# EasyEDA Pro project salvador.epro, board PCB1
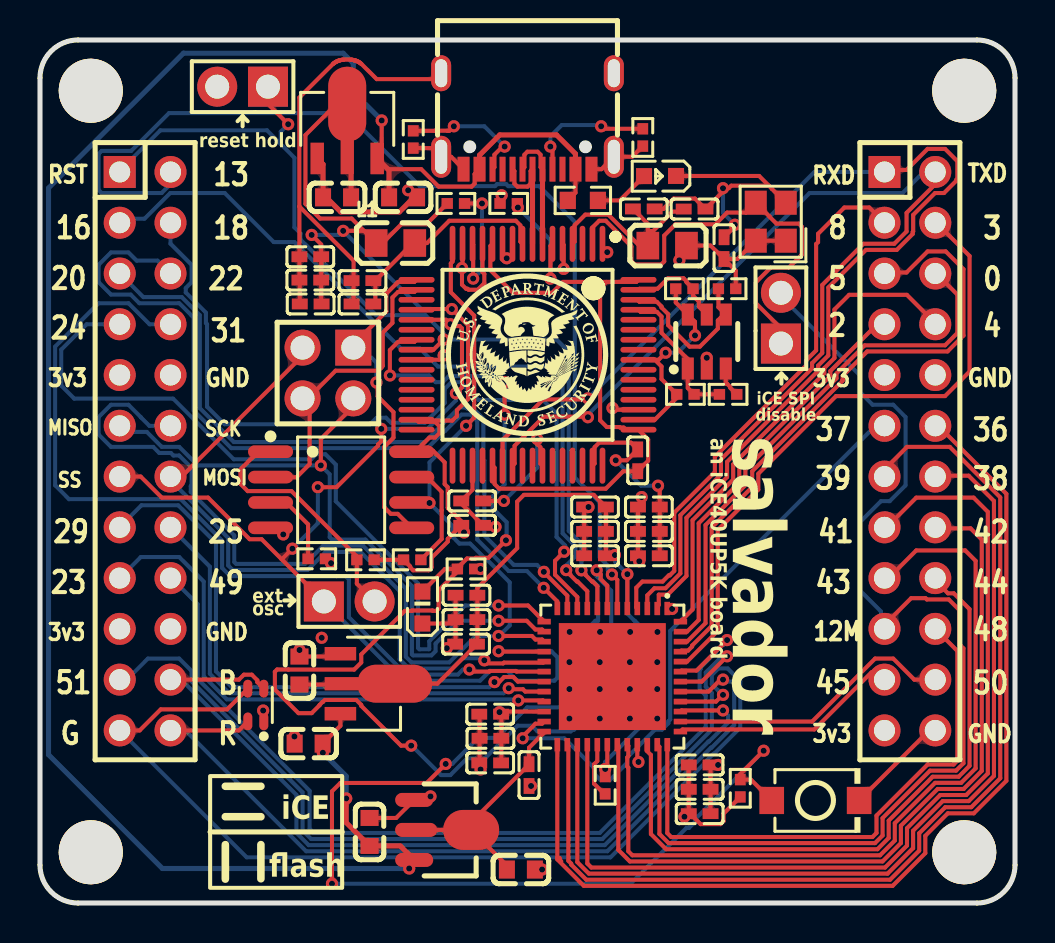
[diagram p1: board, top side]
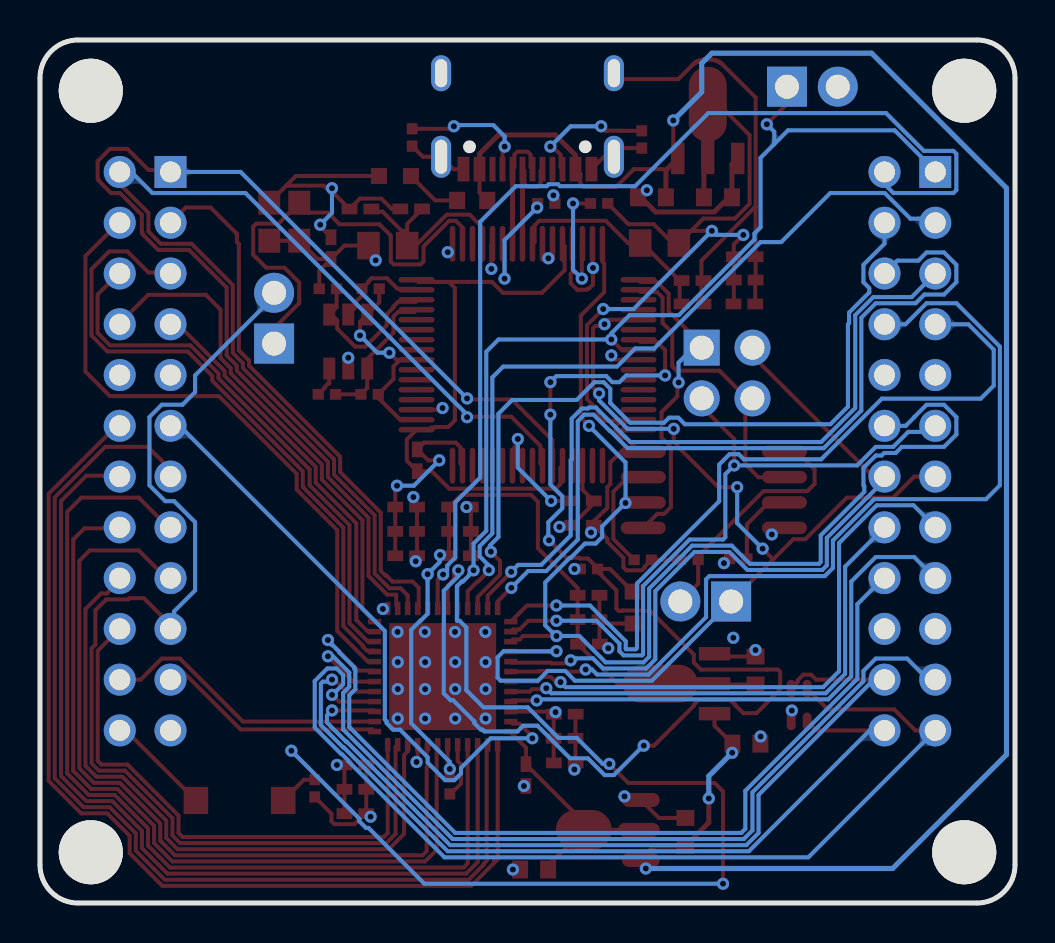
[diagram p2: board, bottom side, seen from below]

Outline 48.77 x 43.18 mm; copper layers: Top Layer, Inner1, Inner2, Bottom Layer. Coordinates in mm from the lower left corner of the outline.
Outline path: 0,41.28 0,1.91 arc(0.56,0.56) 1.91,0 46.86,0 arc(48.21,0.56) 48.77,1.91 48.77,41.28 arc(48.21,42.62) 46.86,43.18 1.91,43.18 arc(0.56,42.62) 0,41.28
Stack: Top Layer 0.035mm Outer layer thickness 1oz / Dielectric1 0.2104mm 7628 RC49% 8.6mil / Inner1 0.0152mm Inner layer thickness / Dielectric2 1.065mm 1.1mm H/HOZ Copper / Inner2 0.0152mm Inner layer thickness / Dielectric3 0.2104mm 7628 RC49% 8.6mil / Bottom Layer 0.035mm Outer layer thickness 1oz

## Design rules (mm)
net D+: DP1
net D-: DP1
template: Custom Config
spacing copperThickness1oz (default): track to track 0.102, other pairs 0.152 to 0.3
spacing copperThickness2oz: track to track 0.203, other pairs 0.152 to 0.3
track width copperThickness1oz (default): min 0.127, default 0.203, max 2.54
track width copperThickness2oz: min 0.203, default 0.254, max 2.54
differential pair differentialPair (default): width min 0.127, default 0.254, max 2.54; gap min 0.152, default 0.152
via viaSize (default): diameter min 0.5, default 0.61, max 10; hole min 0.3, default 0.305, max 6.3

## Placement (name value [footprint] x y rotation side)
C1  10uF  [C0603]  18.16 35.31 0 top
C2  10uF  [C0603]  14.86 35.31 180 top
C3  10uF  [C0603]  16.48 3.56 90 top
C4  10uF  [C0603]  24.05 1.68 0 top
C5  10uF  [C0603]  12.98 11.63 90 top
C6  10uF  [C0603]  13.44 7.98 180 top
C7  1uF  [C0402]  30.45 17.37 0 top
C8  100nF  [C0402]  30.45 18.59 0 top
C9  10nF  [C0402]  30.45 19.81 0 top
C10  1uF  [C0402]  27.76 17.37 180 top
C11  100nF  [C0402]  27.76 18.59 180 top
C12  10nF  [C0402]  27.76 19.81 180 top
C13  1uF  [C0402]  22.52 7.01 180 top
C14  100nF  [C0402]  22.53 8.24 180 top
C15  10nF  [C0402]  22.52 9.45 180 top
C17  100nF  [C0402]  24.46 6.4 270 top
C19  1uF  [C0402]  21.31 12.95 180 top
C20  100nF  [C0402]  21.33 14.18 180 top
C21  10nF  [C0402]  21.33 15.4 180 top
C22  1uF  [C0402]  32.99 6.91 0 top
C23  100nF  [C0402]  32.99 5.69 0 top
C24  10nF  [C0402]  32.99 4.47 0 top
C25  4.7uF  [C0402]  16.13 31.14 180 top
C26  100nF  [C0402]  32.74 34.72 0 top
C27  4.7uF  [C0402]  30.2 34.73 0 top
C28  100nF  [C0402]  16.13 29.97 180 top
C29  4.7uF  [C0402]  29.9 22.15 90 top
C30  100nF  [C0402]  21.62 20.12 180 top
C31  100nF  [C0402]  13.54 29.97 180 top
C32  100nF  [C0402]  13.52 31.17 180 top
C33  100nF  [C0402]  13.52 32.33 180 top
C34  100nF  [C0402]  34.21 32.77 90 top
C35  100nF  [C0402]  21.62 18.9 0 top
H1  PZ254V-11-02P  [HDR-TH_2P-P2.54-V-M]  37.06 29.26 90 top
H2  PZ254V-11-02P  [HDR-TH_2P-P2.54-V-M]  10.13 40.84 180 top
H3  A2541WV-2x2P  [HDR-TH_4P-P2.54-V-R2-C2-S2.54_A2541WV-2X2P]  14.4 26.52 180 top
H4  PZ254V-11-02P  [HDR-TH_2P-P2.54-V-M]  15.47 15.09 0 top
L1  BLM21PG600SN1D  [L0805]  17.78 33.02 0 top
L2  BLM21PG600SN1D  [L0805]  31.37 32.89 180 top
LED1  XL-1608UVC-04  [LED0603-RD_PINK]  31.01 36.37 180 top
LED2  19-219/GHC-YR2T1B5Y/3T  [LED-SMD_L1.6-W0.8_19-219-GHC-YR2T1B5Y-3T]  19.13 14.78 90 top
LED3  TZ-P4-1615RGBTCA1-0.55T  [LED-SMD_4P-L1.6-W1.5-BR_TZ-P4-1615]  10.8 9.91 0 top
NOREF  -  [Pad_e72]  2.54 2.54 0 top
NOREF#2  -  [Pad_e74]  46.23 40.64 0 top
NOREF#3  -  [Pad_e73]  2.54 40.64 0 top
NOREF#4  -  [Pad_e70]  46.23 2.54 0 top
Q1  AMS1117-3.3V  [SOT-89-3_L4.5-W2.5-P1.50-LS4.2-BR]  15.37 38.61 270 top
R1  100Ω  [R0402]  28.27 5.89 90 top
R2  5.1kΩ  [R0402]  30.15 38.3 90 top
R3  5.1kΩ  [R0402]  18.67 38.2 90 top
R4  12kΩ  [R0402]  23.44 35 0 top
R5  1kΩ  [R0402]  20.8 35 0 top
R6  10kΩ  [R0402]  32.28 25.45 0 top
R7  10kΩ  [R0402]  32.23 30.73 0 top
R8  10kΩ  [R0402]  34.37 30.73 180 top
R9  2.2kΩ  [R0402]  34.42 25.45 180 top
R10  330Ω  [R0603]  27.15 35.15 0 top
R11  10kΩ  [R0402]  35.03 5.74 270 top
R12  2.2kΩ  [R0402]  21.31 16.71 180 top
R13  10kΩ  [R0402]  16.28 17.17 0 top
R14  10kΩ  [R0402]  13.84 17.22 0 top
R15  10kΩ  [R0402]  18.62 17.17 180 top
SW1  TS-1088-AR02016  [SW-SMD_L3.9-W3.0-P4.45]  38.79 5.13 0 top
U1  ICE40UP5K-SG48I  [QFN-48_L7.0-W7.0-P0.50-TL-EP5.4-1]  28.63 11.33 270 top
U2  GT-USB-7010ASV  [USB-C-SMD_G-SWITCH_GT-USB-7010ASV]  24.38 39.12 180 top
U3  AMS1117-2.5V  [SOT-89-4_L4.5-W2.5-P1.50-LS4.2-TR]  20.14 3.66 90 top
U4  AMS1117-1.2V-JSM  [SOT-89-3_L4.5-W2.4-P1.50-LS4.0-BR]  16.38 10.97 180 top
U5  FT2232HL-TRAY  [LQFP-64_L10.0-W10.0-P0.50-LS12.0-TL]  24.38 27.43 270 top
U6  12MHz  [OSC-SMD_4P-L2.5-W2.0-BL]  36.55 34.09 90 top
U7  93LC56BT-I/OT  [SOT-23-6_L2.9-W1.6-P0.95-LS2.8-BR]  33.35 28.09 270 top
U8  W25Q64JVSSIQ  [SOIC-8_L5.3-W5.3-P1.27-LS8.0-BL]  15.06 20.68 270 top
U9  2541FV-2x12P  [HDR-TH_24P-P2.54-V-F-R2-C12-S2.54-2]  5.26 22.61 270 top
U10  2541FV-2x12P  [HDR-TH_24P-P2.54-V-F-R2-C12-S2.54-2]  43.51 22.61 270 top

## Footprints (pads in the part's own frame, mm; a bottom-side part is the same pattern mirrored in y, then rotated)
C0402
  rect 0.79x0.54 smd: 1(-0.545,0) 2(0.545,0)
C0603
  rect 0.8x0.9 smd: 1(-0.7,0) 2(0.7,0)
HDR-TH_2P-P2.54-V-M
  rect 2x2 hole 1.2: 1(-1.27,0)
  round 2 hole 1.2: 2(1.27,0)
HDR-TH_4P-P2.54-V-R2-C2-S2.54_A2541WV-2X2P
  rect 1.8x1.8 hole 1.2: 1(-1.27,-1.27)
  round 1.8 hole 1.2: 2(-1.27,1.27) 3(1.27,-1.27) 4(1.27,1.27)
HDR-TH_24P-P2.54-V-F-R2-C12-S2.54-2
  rect 1.6x1.6 hole 1.05: 1(-13.97,-1.27)
  round 1.6 hole 1.05: 2(-13.97,1.27) 3(-11.43,-1.27) 4(-11.43,1.27) 5(-8.89,-1.27) 6(-8.89,1.27) 7(-6.35,-1.27) 8(-6.35,1.27) 9(-3.81,-1.27) 10(-3.81,1.27) 11(-1.27,-1.27) 12(-1.27,1.27) 13(1.27,-1.27) 14(1.27,1.27) 15(3.81,-1.27) 16(3.81,1.27) 17(6.35,-1.27) 18(6.35,1.27) 19(8.89,-1.27) 20(8.89,1.27) 21(11.43,-1.27) 22(11.43,1.27) 23(13.97,-1.27) 24(13.97,1.27)
L0805
  rect 1.133x1.377 smd: 1(-0.966,0) 2(0.966,0)
LED0603-RD_PINK
  rect 0.8x0.8 smd: 1(-0.799,-0.004) 2(0.799,0.004)
LED-SMD_4P-L1.6-W1.5-BR_TZ-P4-1615
  oval 0.448x0.889 smd: 1(0.4,-0.82) 2(-0.4,-0.82) 3(-0.4,0.82) 4(0.4,0.82)
LED-SMD_L1.6-W0.8_19-219-GHC-YR2T1B5Y-3T
  rect 0.8x0.8 smd: 1(0.799,0) 2(-0.799,0)
LQFP-64_L10.0-W10.0-P0.50-LS12.0-TL
  oval 1.8x0.28 smd: 1(-5.55,3.75) 2(-5.55,3.25) 3(-5.55,2.75) 4(-5.55,2.25) 5(-5.55,1.75) 6(-5.55,1.25) 7(-5.55,0.75) 8(-5.55,0.25) 9(-5.55,-0.25) 10(-5.55,-0.75) 11(-5.55,-1.25) 12(-5.55,-1.75) 13(-5.55,-2.25) 14(-5.55,-2.75) 15(-5.55,-3.25) 16(-5.55,-3.75) 33(5.55,-3.75) 34(5.55,-3.25) 35(5.55,-2.75) 36(5.55,-2.25) 37(5.55,-1.75) 38(5.55,-1.25) 39(5.55,-0.75) 40(5.55,-0.25) 41(5.55,0.25) 42(5.55,0.75) 43(5.55,1.25) 44(5.55,1.75) 45(5.55,2.25) 46(5.55,2.75) 47(5.55,3.25) 48(5.55,3.75)
  oval 0.28x1.8 smd: 17(-3.75,-5.55) 18(-3.25,-5.55) 19(-2.75,-5.55) 20(-2.25,-5.55) 21(-1.75,-5.55) 22(-1.25,-5.55) 23(-0.75,-5.55) 24(-0.25,-5.55) 25(0.25,-5.55) 26(0.75,-5.55) 27(1.25,-5.55) 28(1.75,-5.55) 29(2.25,-5.55) 30(2.75,-5.55) 31(3.25,-5.55) 32(3.75,-5.55) 49(3.75,5.55) 50(3.25,5.55) 51(2.75,5.55) 52(2.25,5.55) 53(1.75,5.55) 54(1.25,5.55) 55(0.75,5.55) 56(0.25,5.55) 57(-0.25,5.55) 58(-0.75,5.55) 59(-1.25,5.55) 60(-1.75,5.55) 61(-2.25,5.55) 62(-2.75,5.55) 63(-3.25,5.55) 64(-3.75,5.55)
OSC-SMD_4P-L2.5-W2.0-BL
  rect 1.2x1.1 smd: 1(-0.95,-0.75) 2(0.95,-0.75) 3(0.95,0.75) 4(-0.95,0.75)
Pad_e70
  round 3.2 hole 3.2: 1(0,0)
Pad_e72
  round 3.2 hole 3.2: 1(0,0)
Pad_e73
  round 3.2 hole 3.2: 1(0,0)
Pad_e74
  round 3.2 hole 3.2: 1(0,0)
QFN-48_L7.0-W7.0-P0.50-TL-EP5.4-1
  rect 0.665x0.28 smd: 1(-3.408,2.75) 2(-3.408,2.25) 3(-3.408,1.75) 4(-3.408,1.25) 5(-3.408,0.75) 6(-3.408,0.25) 7(-3.408,-0.25) 8(-3.408,-0.75) 9(-3.408,-1.25) 10(-3.408,-1.75) 11(-3.408,-2.25) 12(-3.408,-2.75) 25(3.408,-2.75) 26(3.408,-2.25) 27(3.408,-1.75) 28(3.408,-1.25) 29(3.408,-0.75) 30(3.408,-0.25) 31(3.408,0.25) 32(3.408,0.75) 33(3.408,1.25) 34(3.408,1.75) 35(3.408,2.25) 36(3.408,2.75)
  rect 0.28x0.665 smd: 13(-2.75,-3.408) 14(-2.25,-3.408) 15(-1.75,-3.408) 16(-1.25,-3.408) 17(-0.75,-3.408) 18(-0.25,-3.408) 19(0.25,-3.408) 20(0.75,-3.408) 21(1.25,-3.408) 22(1.75,-3.408) 23(2.25,-3.408) 24(2.75,-3.408) 37(2.75,3.408) 38(2.25,3.408) 39(1.75,3.408) 40(1.25,3.408) 41(0.75,3.408) 42(0.25,3.408) 43(-0.25,3.408) 44(-0.75,3.408) 45(-1.25,3.408) 46(-1.75,3.408) 47(-2.25,3.408) 48(-2.75,3.408)
  rect 5.35x5.35 smd: 49(0,0)
R0402
  rect 0.566x0.54 smd: 1(-0.433,0) 2(0.433,0)
R0603
  rect 0.806x0.864 smd: 1(-0.753,0) 2(0.753,0)
SOIC-8_L5.3-W5.3-P1.27-LS8.0-BL
  oval 0.63x2.25 smd: 1(-1.905,-3.53) 2(-0.635,-3.53) 3(0.635,-3.53) 4(1.905,-3.53) 5(1.905,3.53) 6(0.635,3.53) 7(-0.635,3.53) 8(-1.905,3.53)
SOT-23-6_L2.9-W1.6-P0.95-LS2.8-BR
  rect 1.1x0.6 smd: 1(1.35,-0.95) 2(1.35,0) 3(1.35,0.95) 4(-1.35,0.95) 5(-1.35,0) 6(-1.35,-0.95)
SOT-89-3_L4.5-W2.4-P1.50-LS4.0-BR
  rect 1.575x0.672 smd: 1(1.357,-1.5) 3(1.357,1.5)
  custom 5.377x1.9 smd: 2(-1.357,-0.001)
SOT-89-3_L4.5-W2.5-P1.50-LS4.2-BR
  rect 1.575x0.672 smd: 1(1.356,-1.5) 3(1.356,1.5)
  custom 5.377x1.9 smd: 2(-1.356,0)
SOT-89-4_L4.5-W2.5-P1.50-LS4.2-TR
  oval 0.7x1.9 smd: 1(1.501,1.425) 3(-1.501,1.425)
  oval 0.7x2.1 smd: 2(0,1.326)
  oval 2x2.8 smd: 4(0,-1.425)
SW-SMD_L3.9-W3.0-P4.45
  rect 1.23x1.36 smd: 1(-2.185,0) 2(2.185,0)
USB-C-SMD_G-SWITCH_GT-USB-7010ASV
  oval 1x2.1 hole 0.6x1.7: 1(-4.32,1.78) 2(4.32,1.78)
  oval 1x1.8 hole 0.6x1.4: 3(4.32,-2.4) 4(-4.32,-2.4)
  rect 0.6x1.24 smd: A1B12(-3.2,2.4) A4B9(-2.4,2.4) B1A12(3.2,2.4) B4A9(2.4,2.4)
  rect 0.3x1.24 smd: A5(-1.25,2.4) A6(-0.25,2.4) A7(0.25,2.4) A8(1.25,2.4) B5(1.75,2.4) B6(0.75,2.4) B7(-0.75,2.4) B8(-1.75,2.4)

## Nets
As in the schematic.

Pads without a net: NOREF 1; NOREF#2 1; NOREF#3 1; NOREF#4 1; U2 A8 B8; U5 3 19 22 26 27 28 29 30 32 33 34 36 40 41 43 44 45 46 48 52 53 54 55 57 58 59 60

## Via types
v1: diameter 0.61, hole 0.305, Top Layer to Bottom Layer, 117 vias

## Routing (per net, layer and track width the routed paths; a pad name or vN(x,y) marks a point on that pad's centre or on a via; arc(x,y) is an arc through that point)
+1V2: length 40.1
  Top Layer w0.203: v1(28.27,6.71) 28.38,6.81 U1.30 ; C5.1 17.7,10.93 17.74,10.97 19.87,10.97 C19.1 21.88,12.97 C20.1 C21.1 21.88,15.77 23.87,17.75 23.87,20.08 24.21,20.42 27.7,20.42 C12.1 C11.1 C10.1 ; v1(29.38,16.45) 29.38,14.74 U1.5
  Top Layer w0.254: 28.28,17.37 C10.1
  Bottom Layer w0.203: v1(28.76,17.41) 28.78,17.39 28.78,17.06 v1(29.38,16.45) 29.38,14.48 29.73,14.12 29.75,14.12 30.2,13.67 30.2,8.99 28.27,7.06 v1(28.27,6.71)
+2V5: length 11.9
  Top Layer w0.203: U3.4 23.35,1.87 C4.1 ; U3.4 21.59,3.68 21.59,4.07 24.46,6.93 C17.1 24.46,7.77 25.27,8.58 ; U3.4 18.82,3.66
+3V3: length 95.8
  Top Layer w0.203: v1(29.93,7.06) 29.88,7.12 U1.33 ; 18.89,24.13 18.94,24.08 19.76,24.08 19.99,23.84 19.99,23.52 19.76,23.29 19.48,23.29 18.9,22.71 18.9,22.58 ; 18.89,24.13 19.8,24.13 19.8,24.14 20.62,24.14 20.85,24.37 20.85,24.65 21.41,25.22 21.41,28.91 v1(20.6,29.72) 18.87,29.72 U5.20 ; 18.89,24.13 U5.31 ; R7.1 31.8,30.04 U7.6 32.76,29.08 v1(32.76,28.4) ; v1(13.59,33.43) 14.07,32.95 C33.1 C32.1 14.07,29.99 C31.1 ; 20.37,35 19.33,33.96 18.08,33.96 17.13,33.02 L1.1 16.2,33.63 ; 29.94,24.18 30.75,24.18 31.85,25.28 R6.1 31.09,26.21 31.09,26.84 30.75,27.18 ; C9.1 C8.1 C7.1 29.91,17.32 ; 30.75,27.18 30.94,27.18 v1(31.29,27.53) ; 30.75,27.18 U5.56 ; U5.42 25.03,21.99 25.03,22.81 24.87,22.97 v1(24.87,23.22) ; v1(22.98,9.55) 23.01,9.58 U1.22 ; L2.1 33.54,32.89 C34.1 ; Q1.2 14.82,39.96 13.28,38.42 13.28,34.98 14.01,34.25 15.59,34.25 16.2,33.63 ; C34.1 34.88,32.22 U6.4 U6.1 ; C34.1 34.8,31.64 R8.1 ; C15.1 23.08,9.44 C14.1 23.08,7.02 C13.1 ; 16.2,33.63 v1(15.16,33.63) ; 18.9,22.58 18.95,22.63 19.66,22.63 20.24,22.05 20.24,20.96 20.39,20.81 20.39,19.78 20.42,19.75 20.42,19.74 20.57,19.59 20.58,19.59 21.07,19.1 C35.1 20.4,18.22 20.4,18.08 19.59,17.28 19.59,16.8 19.44,16.65 18.66,16.65 18.51,16.8 18.51,16.84 R15.2 R13.2 ; 18.9,22.58 18.59,22.58 ; C22.1 C23.1 C24.1 32.52,4.47 33.04,3.95 34.04,3.95 34.19,4.1 34.19,4.47 R11.2 ; C30.1 v1(23.2,20.12)
  Top Layer w0.254: Q1.2 15.56,39.77 C2.1
  Bottom Layer w0.203: v1(32.76,28.4) 31.9,27.53 v1(31.29,27.53) ; v1(24.87,23.22) 24.87,21.78 v1(23.2,20.12) ; v1(20.6,29.72) 19.08,29.72 v1(15.16,33.63) 14.96,33.43 v1(13.59,33.43)
  vias: v1(11.16,9.63) v1(14.56,17) v1(21.21,18.54) v1(22.03,16.71) v1(29.97,17.1) v1(30.09,20.31) v1(31.62,14.71) v1(31.98,32.16) v1(32.23,4.32)
+5V: length 99.6
  Top Layer w0.203: v1(17.09,39.15) 17.09,37.48 Q1.3 ; U2.B4A9 21.74,36.47 21.74,35.99 21.59,35.84 19.94,35.84 19.07,36.72 17.4,36.72 ; C6.1 15.03,8.87 U4.3 ; U2.A4B9 26.78,35.54 R10.1
  Top Layer w0.254: v1(18.47,1.73) 18.72,1.98 U3.3 18.02,2.86 C3.1 15.32,4.02 v1(15.32,5.23) ; Q1.3 17.46,36.66 C1.1 ; U2.A4B9 26.78,37.48 25.84,38.43 23,38.43 21.98,37.42 U2.B4A9
  Bottom Layer w0.254: v1(18.47,1.73) 6.12,1.73 0.43,7.42 0.43,35.77 7.18,42.52 15.16,42.52 15.67,42.01 15.67,40.57 v1(17.09,39.15) ; v1(14.15,7.52) 15.32,6.35 v1(15.32,5.23)
GND: length 99.4
  Top Layer w0.203: v1(28.63,24.77) 28.72,24.68 U5.51 ; v1(20.19,27.4) 19.97,27.18 U5.25 ; 36.46,35.89 34.58,35.89 34.45,35.76 v1(34.16,35.76) 34.16,35.6 C26.2 32.76,35.25 31.7,35.25 31.18,34.73 C27.2 ; 36.46,35.89 36.6,35.74 36.6,35.73 U6.2 ; 36.46,35.89 35.97,36.38 LED1.1 ; 12.97,34.85 15.69,32.14 15.69,29.92 ; 12.97,34.85 C33.2 C32.2 12.99,31.15 C31.2 ; 12.97,34.85 12.97,34.85 12.97,40.3 14.66,41.98 14.66,41.98 14.69,42.01 14.7,42.01 14.73,42.04 14.74,42.04 14.76,42.06 14.77,42.06 14.8,42.08 14.81,42.08 14.83,42.1 14.85,42.1 14.87,42.12 14.89,42.12 14.91,42.14 14.93,42.14 14.95,42.15 14.98,42.15 14.99,42.17 15.02,42.17 15.03,42.18 15.06,42.18 15.07,42.18 15.11,42.18 15.11,42.19 15.15,42.19 15.16,42.19 15.19,42.19 15.2,42.2 15.54,42.2 15.54,42.19 15.58,42.19 15.58,42.19 15.62,42.19 15.63,42.18 15.66,42.18 15.67,42.18 15.7,42.18 15.71,42.17 15.74,42.17 15.76,42.15 15.78,42.15 15.8,42.14 15.82,42.14 15.84,42.12 15.86,42.12 15.88,42.1 15.9,42.1 15.92,42.08 15.94,42.08 15.96,42.06 15.97,42.06 16,42.04 16.01,42.04 16.03,42.01 16.04,42.01 16.07,41.98 16.07,41.98 16.84,41.22 19.67,41.22 19.96,41.52 20.06,41.52 ; U4.1 14.89,12.33 C5.2 ; v1(34.75,33.94) 34.75,33.85 C34.2 ; C19.2 20.79,12.97 C20.2 ; SW1.2 44.48,8.64 44.78,8.64 ; U5.35 21.63,20.68 C30.2 21.07,19.99 C35.2 ; C20.2 C21.2 ; C20.2 20.59,13.98 LED2.2 ; C7.2 C8.2 C9.2 31,20.79 v1(30.91,20.88) ; U2.A1B12 28.08,36.72 U2.1 29.62,37.34 R2.1 ; U5.5 26.19,32.92 v1(26.19,31.73) ; C10.2 C11.2 C12.2 ; R3.1 19.63,37.77 20.06,37.34 20.56,37.34 21.18,36.72 ; C15.2 21.98,9.44 C14.2 21.98,7.02 C13.2 ; v1(28.8,22.15) 29.35,22.15 C29.2 29.55,23.04 27.97,23.04 27.74,22.81 27.74,21.99 U5.47 ; U3.1 17.81,4.26 C3.2 ; U5.15 21.13,31.8 v1(21.11,31.77) 21.11,30.94 21.31,30.73 21.38,30.73 21.44,30.68 21.9,30.68 22.22,31.01 22.22,31.47 22.13,31.56 U5.13 ; C22.2 C23.2 C24.2
  Top Layer w0.254: Q1.1 14.16,36.96 C2.2 14.31,35.31 15.04,34.58 17.98,34.58 18.71,35.31 C1.2
  Bottom Layer w0.203: v1(28.8,22.15) 30.07,20.88 v1(30.91,20.88) ; v1(34.16,35.76) 34.16,34.53 v1(34.75,33.94)
  vias: v1(12.17,18.44) v1(12.73,8.33) v1(12.98,12.66) v1(18.42,35.66) v1(19.53,5.33) v1(20.35,12.75) v1(22.04,6.68) v1(22.78,18.82) v1(23.09,35.41) v1(23.34,32.26) v1(24.56,5.86) v1(25.11,1.68) v1(26.49,13.56) v1(26.48,12.05) v1(26.48,10.7) v1(26.48,9.23) v1(27.44,19.81) v1(28.01,13.56) v1(28,12.05) v1(28,10.7) v1(28,9.23) v1(28.37,32.56) v1(29.52,13.56) v1(29.51,12.05) v1(29.51,10.7) v1(29.51,9.23) v1(30.88,13.56) v1(30.87,12.05) v1(30.87,10.7) v1(30.87,9.23) v1(33.35,27.28) v1(33.92,6.91)
(no net):
  vias: v1(14.09,13.27)
0A: length 27.1
  Top Layer w0.203: 44.83,31.5 45.88,30.44 45.88,28.52 45.27,27.9 41.25,27.9 39.84,26.49 39.84,26.25 35.28,21.69 35.28,20.9 33.29,18.91 33.29,14 32.36,13.08 U1.46
2A: length 20.1
  Top Layer w0.203: U1.47 32.36,13.58 32.95,14.16 32.95,19 34.98,21.03 34.98,21.82 39.53,26.38 39.53,26.62 41.87,28.96 42.29,28.96
3B_G6: length 32
  Top Layer w0.203: U1.44 32.36,12.08 33.9,13.61 33.9,18.66 35.93,20.69 35.93,21.48 39.81,25.36 45.27,25.36 46.5,26.59 46.5,32.37 44.83,34.04
4A: length 24.8
  Top Layer w0.203: 44.83,28.96 43.36,30.43 40.47,30.43 39.74,29.69 39.74,27.27 39.23,26.76 39.23,26.5 34.67,21.95 34.67,21.18 32.64,19.15 32.64,14.69 U1.48
5B: length 32.3
  Top Layer w0.203: U1.45 32.08,12.63 32.42,12.63 32.62,12.83 32.62,12.88 33.59,13.86 33.59,18.78 35.59,20.78 35.59,20.83 35.62,20.86 35.62,21.6 40.14,26.12 40.14,26.18 40.15,26.18 40.15,26.37 41.37,27.6 45.39,27.6 46.19,28.39 46.19,31.71 45.3,32.6 44.39,32.6 43.34,31.55 42.34,31.55 42.29,31.5
8A: length 27.4
  Top Layer w0.203: 42.29,34.04 U10.3 41.48,34.8 40.23,34.8 38.92,33.48 38.92,33.07 38.82,32.97 38.82,27.65 38.31,27.14 38.31,26.89 33.75,22.33 33.75,21.56 31.72,19.53 31.72,16.62 31.5,16.39 31.45,16.39 31.14,16.08 30.13,16.08 29.83,15.78 29.83,14.79 U1.4
13B: length 53.5
  Top Layer w0.203: U1.6 28.88,16.17 v1(28.61,16.44)
  Bottom Layer w0.203: v1(28.61,16.44) 28.4,16.64 28.4,16.88 27.99,17.28 27.99,20.04 26.75,21.29 26.75,34.08 24.97,35.87 23.42,35.87 23.32,35.97 22.86,35.97 22.76,35.87 19,35.87 15.34,39.52 6.45,39.52 4.56,37.63 3.08,37.63 2.93,37.48 2.93,35.67 3.08,35.52 6.08,35.52 6.53,35.97 U9.2
16A: length 39.1
  Top Layer w0.203: v1(26.32,16.66) 26.52,16.45 26.52,16.42 26.85,16.09 26.89,16.09 27.38,15.6 U1.9
  Bottom Layer w0.203: v1(26.32,16.66) 26.32,16.89 26.78,17.35 26.78,17.86 26.14,18.49 26.14,26.3 25.6,26.84 19.9,26.84 19,27.74 18.05,27.74 12.72,33.07 11.69,33.07 9.24,35.52 6.51,35.52 5.23,34.24 4.19,34.24 U9.3
18A: length 40.8
  Top Layer w0.203: U1.10 26.88,15.31 25.76,16.42 25.76,17.12 v1(26.22,17.58)
  Bottom Layer w0.203: v1(26.22,17.58) 26.27,17.63 26.27,17.88 25.84,18.32 25.84,24.48 25.15,25.17 21.93,25.17 21.04,26.06 20.57,26.06 20.25,25.73 20.25,25.02 19.25,24.03 17.56,24.03 17.3,24.28 16.84,24.28 16.51,23.95 9.23,23.95 8.36,24.83 8.36,28.96 8.3,29.02 8.3,29.54 7.29,30.55 7.29,30.77 7.58,31.06 7.58,31.93 6.53,32.99 U9.4
20A: length 37.3
  Top Layer w0.203: v1(25.2,16.57) 25.2,16.55 26.38,15.38 U1.11
  Bottom Layer w0.203: U9.5 5.17,30.31 7.09,30.31 7.99,29.41 7.99,24.76 9.69,23.06 19.24,23.06 20.97,24.79 21.31,24.79 21.36,24.74 21.67,24.74 22.17,24.23 22.17,22.2 22.22,22.15 22.22,18.39 23.7,16.92 24.86,16.92 v1(25.2,16.57)
22A: length 42.6
  Top Layer w0.203: U1.12 25.88,15.09 v1(25.19,15.77)
  Bottom Layer w0.203: U9.6 5.88,32.14 4.83,32.14 4.42,32.55 3.55,32.55 2.93,31.93 2.93,31.06 3.55,30.44 4.53,30.44 4.97,30.01 6.96,30.01 7.69,29.29 7.69,24.64 9.57,22.76 19.38,22.76 20.24,23.62 20.27,23.62 21.08,24.43 21.54,24.43 21.87,24.11 21.87,18.19 23.44,16.61 24.35,16.61 v1(25.19,15.77)
23B: length 27.4
  Top Layer w0.203: U1.21 25.16,10.14 v1(23.93,10.14)
  Bottom Layer w0.203: v1(23.93,10.14) 23.87,10.19 9.34,10.19 8.19,11.34 8.19,16.08 6.96,17.31 5.04,17.31 U9.17
24A: length 39.5
  Top Layer w0.203: U1.13 24.41,14.88 v1(22.94,14.88)
  Bottom Layer w0.203: v1(22.94,14.88) 21.26,14.88 19.47,13.1 19.47,12.71 19.45,12.69 18.97,12.69 18.91,12.76 18.91,15.99 14.8,20.1 14.8,21.94 14.28,22.45 13.81,22.45 13.56,22.2 9.69,22.2 6.66,25.23 1.71,25.23 1.06,25.89 1.06,27.69 2.33,28.96 U9.7
25B_G3: length 25.4
  Top Layer w0.203: U1.20 24.27,10.58 24.16,10.7 23.5,10.7 v1(23.45,10.75)
  Bottom Layer w0.203: v1(23.45,10.75) 23.19,10.49 9.47,10.49 8.5,11.47 8.5,16.83 U9.16
29B: length 29.5
  Top Layer w0.203: U1.19 23.91,11.08 23.68,11.31 23.21,11.31 22.99,11.08 22.76,11.08 v1(22.73,11.05)
  Bottom Layer w0.203: v1(22.73,11.05) 22.48,10.8 9.6,10.8 8.8,11.59 8.8,18.01 6.91,19.9 5.08,19.9 3.99,18.81 U9.15
31B: length 44.5
  Top Layer w0.203: U1.18 23.84,11.58 23.8,11.61 22.5,11.61 22.47,11.58 21.58,11.58 v1(21.47,11.68)
  Bottom Layer w0.203: U9.8 5.48,28.96 4.42,30.01 2.93,30.01 0.76,27.84 0.76,20.9 1.45,20.21 7.04,20.21 9.11,18.14 9.11,16.76 9.51,16.36 15.29,16.36 15.45,16.19 15.45,14.3 18.32,11.43 20.9,11.43 21.16,11.68 v1(21.47,11.68)
36B: length 51
  Top Layer w0.203: 25.88,2.29 25.91,2.25 25.99,2.25 25.99,2.17 26.07,2.09 ; 25.88,2.29 25.88,2.18 27.2,0.86 42.65,0.86 44.28,2.49 44.28,3.36 45.41,4.49 46.71,4.49 48.34,6.12 48.34,20.47 44.93,23.88 44.83,23.88 ; 25.88,2.29 U1.25
37A: length 30.8
  Top Layer w0.203: U1.23 25.11,8.97 24.78,8.97 24.14,8.33 v1(24.14,8.24)
  Bottom Layer w0.203: U10.11 41.78,23.88 31.52,13.61 31.52,9.18 31.43,9.09 31.43,9 31.1,8.67 30.76,8.67 29.38,7.29 29.38,7.02 28.5,6.15 28.04,6.15 27.71,6.48 27.71,6.76 26.23,8.24 v1(24.14,8.24)
38B: length 46.7
  Top Layer w0.203: U1.27 26.88,2.05 27.45,1.47 42.39,1.47 43.67,2.75 43.67,3.62 45.15,5.1 46.45,5.1 47.71,6.36 47.71,20.12 46.45,21.38 44.88,21.38 44.83,21.34
39A: length 52.2
  Top Layer w0.203: 42.29,21.34 42.34,21.39 42.34,21.79 43.37,22.82 45.5,22.82 48.03,20.3 48.03,6.24 46.58,4.79 45.28,4.79 43.98,3.49 43.98,2.62 42.52,1.17 27.33,1.17 26.57,1.92 26.57,1.97 26.43,2.12 26.43,7.87 U1.26
41A: length 47.6
  Top Layer w0.203: 42.29,18.8 42.34,18.8 43.83,20.28 46.7,20.28 47.41,19.57 47.41,6.48 46.33,5.4 45.03,5.4 43.37,3.74 43.37,2.87 42.27,1.78 27.58,1.78 27.38,1.98 U1.28
42B: length 40.2
  Top Layer w0.203: U1.31 28.93,7.87 28.93,2.66 29.5,2.08 42.14,2.08 43.06,3 43.06,3.87 44.9,5.71 46.2,5.71 47.1,6.61 47.1,18.19 46.55,18.75 44.88,18.75 44.83,18.8
43A: length 40.8
  Top Layer w0.203: U1.32 29.43,7.87 29.43,7.34 29.38,7.29 29.38,6.83 29.43,6.77 29.43,2.59 29.63,2.39 42.02,2.39 42.75,3.13 42.75,4 44.77,6.01 46.07,6.01 46.8,6.74 46.8,17.12 46.28,17.64 43.83,17.64 42.44,16.26 42.29,16.26
44B: length 33.3
  Top Layer w0.203: U1.34 30.36,7.9 30.36,7.61 30.56,7.41 30.56,3.45 31.32,2.69 41.89,2.69 42.45,3.25 42.45,4.12 44.65,6.32 45.95,6.32 46.49,6.86 46.49,14.71 45.71,15.49 45.42,15.49 44.78,16.13 44.78,16.26
45A_G1: length 11.6
  Top Layer w0.203: U10.21 41.88,11.54 41.59,11.54 38.73,8.69 32.14,8.69 U1.37
48B: length 28.2
  Top Layer w0.203: U1.36 31.38,3.5 31.57,3.3 41.64,3.3 41.84,3.5 41.84,4.37 44.39,6.93 45.69,6.93 45.88,7.12 45.88,12.61 44.78,13.72
49A: length 45.6
  Top Layer w0.203: v1(34.37,13.16) 32.84,11.63 32.08,11.63 U1.43
  Bottom Layer w0.203: U9.18 6.58,16.26 7.89,14.95 7.89,11.22 13.49,5.61 13.49,3.71 13.69,3.51 28,3.51 33.3,8.81 33.3,10.39 32.99,10.69 32.99,11.66 33.05,11.71 33.05,11.78 33.81,12.55 33.81,12.58 34.14,12.9 34.16,12.9 34.37,13.11 v1(34.37,13.16)
50B: length 14.5
  Top Layer w0.203: 44.78,11.18 43.73,11.18 42.68,12.23 41.77,12.23 38.62,9.08 U1.38
51A: length 44.7
  Top Layer w0.203: v1(34.37,12.34) 33.1,11.08 U1.42
  Bottom Layer w0.203: U9.21 4.34,11.18 5.4,12.23 6.96,12.23 7.58,11.61 7.58,11.09 13.13,5.54 13.13,3.63 13.56,3.2 28.13,3.2 33.6,8.68 33.6,10.51 33.3,10.82 33.3,11.54 34.11,12.34 v1(34.37,12.34)
#CRESET: length 103.3
  Top Layer w0.203: v1(14.61,0.97) 14.61,5.59 15.02,6.01 19.34,6.01 v1(20.29,6.96) ; U1.8 27.88,15.85 27.64,16.09 27.61,16.09 27.28,16.42 27.28,16.44 v1(27.08,16.65) ; v1(12.41,38.96) 12.41,38.97 10.85,40.54 ; U5.24 19.68,27.68 v1(20.19,28.2) ; v1(36.19,7.62) 35.03,6.45 35.03,6.17 35.56,6.17 SW1.1
  Bottom Layer w0.203: v1(36.19,7.62) 32.79,4.22 32.79,4.09 32.46,3.76 32.33,3.76 29.54,0.97 v1(14.61,0.97) ; v1(20.29,6.96) 20.62,6.96 21.92,8.26 22.84,8.26 24.37,9.79 26.58,9.79 27.44,10.65 27.44,13.78 27.78,14.12 27.91,14.12 27.91,15.85 27.68,16.09 27.61,16.09 27.28,16.42 27.28,16.48 27.12,16.65 v1(27.08,16.65) 27.08,17.98 26.45,18.62 26.45,27.58 25.83,28.2 v1(20.19,28.2) 20.19,28.5 19.28,29.41 16.81,29.41 13.03,33.2 13.03,33.5 12.73,33.81 12.73,37.29 12.04,37.97 ; 3.94,36.58 6.02,38.66 11.35,38.66 12.04,37.97 ; 12.04,37.97 12.04,38.59 v1(12.41,38.96)
CDONE: length 65.5
  Top Layer w0.203: v1(27.84,16.65) 28.05,16.44 28.05,16.21 28.37,15.88 ; v1(18.57,7.87) 18.06,7.87 16.07,9.87 16.07,9.91 15.82,10.16 14.25,10.16 14.15,10.06 14.13,10.06 13.99,9.91 13.99,9.9 13.59,9.5 12.93,9.5 11.75,10.68 11.75,11.57 11.86,11.68 12.42,11.68 12.42,11.68 15.72,11.68 16.07,12.03 16.07,12.44 18.25,14.62 18.6,14.62 18.62,14.64 19.63,14.64 19.65,14.62 19.82,14.62 19.94,14.73 19.94,15.65 20.88,16.59 20.88,16.71 ; 20.88,16.71 20.26,16.71 LED2.1 ; 20.88,16.71 20.88,16.76 21.36,17.24 21.77,17.24 21.8,17.27 22.43,17.27 v1(23.31,18.15) ; U1.7 28.38,15.88 ; v1(17.5,26.4) 17.5,26.4 17.5,27.67 17.91,28.08 18.73,28.08 U5.23 ; v1(23.24,26.06) v1(23.24,24.44)
  Bottom Layer w0.203: v1(23.31,18.15) 23.34,18.18 23.34,19.05 22.65,19.75 22.65,20.35 23.24,20.94 v1(23.24,24.44) ; v1(27.84,16.65) 27.84,16.35 28.57,15.63 28.57,13.62 28.58,13.61 28.58,10.49 28.23,10.15 28.1,10.15 27.04,9.08 27.04,9 26.71,8.67 26.63,8.67 26.54,8.59 24.88,8.59 24.6,8.87 23.88,8.87 22.25,7.24 21.36,7.24 20.53,6.4 20.06,6.4 18.59,7.87 v1(18.57,7.87) ; v1(23.24,26.06) 22.94,26.36 20.45,26.36 20.14,26.06 19.79,26.06 19.45,26.4 v1(17.5,26.4)
D+: length 6.2
  Top Layer w0.203: U2.A6 24.54,36.62 24.54,35.99 24.39,35.84 23.88,35.84 23.73,35.99 23.73,36.62 U2.B6
  Top Layer w0.254: U2.A6 U5.8
D-: length 6.2
  Top Layer w0.203: U2.A7 24.23,36.81 24.23,37.44 24.38,37.59 24.89,37.59 25.04,37.44 25.04,36.81 U2.B7
  Top Layer w0.254: U5.7 U2.B7
EE_CLK: length 8.1
  Top Layer w0.203: R8.2 33.93,29.81 U7.4 34.25,29.39 34.15,29.39 33.9,29.15 33.9,28.74 33.01,27.84 32.49,27.84 31.42,28.91 31.42,29.46 31.09,29.79 31.09,29.84 30.85,30.08 29.98,30.08 29.93,30.13 U5.62
EE_CS: length 4.8
  Top Layer w0.203: U5.63 29.99,30.73 30.89,30.73 31.41,31.26 32.19,31.26 32.34,31.11 32.34,31.06 32.67,30.73 32.67,30.39 32.95,30.1 32.95,29.84 U7.5
EE_DATA: length 7.1
  Top Layer w0.203: U5.61 30.04,29.58 30.86,29.58 31.09,29.34 31.09,28.53 32.4,27.22 U7.1 32.4,25.77 R6.2 33.98,25.45
FLASH_MISO: length 14.6
  Top Layer w0.203: U5.18 18.73,30.58 17.91,30.58 17.63,30.29 17.63,29.02 17.15,28.54 17.15,26.88 17.08,26.81 17.08,26.78 16.93,26.63 14.79,26.63 13.54,25.39 13.54,25.25 13.49,25.2 13.49,21.96 12.83,21.3 11.85,21.3 11.84,21.31
FLASH_MOSI: length 15.7
  Top Layer w0.203: 16.08,27.79 16.08,28.35 17.32,29.6 17.32,30.49 17.91,31.08 18.73,31.08 U5.17 ; v1(16.83,26.04) 16.89,25.98 16.89,25.35 17.68,24.56 17.68,23.28 17.21,22.82 17.21,19.81 17.55,19.47 17.89,19.47 18.59,18.77
  Bottom Layer w0.203: 16.08,27.79 16.83,27.04 v1(16.83,26.04)
ICE_CLK: length 56.6
  Top Layer w0.203: 42.29,13.72 42.23,13.78 42.23,13.91 43.57,15.25 44.29,15.25 44.36,15.19 45.45,15.19 46,14.64 46,12.93 46.19,12.74 46.19,6.99 45.82,6.62 44.52,6.62 42.14,4.25 42.14,3.38 41.76,3 31.44,3 30.98,3.46 30.98,7.81 U1.35
  Bottom Layer w0.203: 37.06,30.53 36.88,30.35 37.02,30.22 37.19,30.22 41.01,26.4 41.01,25.56 41.64,24.93 42.68,24.93 43.29,24.31 43.29,20.9 42.5,20.1 42.06,20.1 41.01,19.05 41.01,15.64 42.06,14.59 42.06,13.89 U10.19
ICE_MISO: length 35.2
  Top Layer w0.203: v1(22.94,14.12) 24.34,14.12 24.78,13.69 25.11,13.69 U1.14 ; v1(14.05,21.89) 14.05,23.22 16.08,25.25
  Bottom Layer w0.203: v1(22.94,14.12) 20.93,14.12 19.79,12.98 19.79,12.6 19.58,12.39 18.66,12.39 18.6,12.45 18.6,15.86 16.28,18.19 14.61,18.19 14.49,18.3 14.49,21.45 v1(14.05,21.89) 7.89,21.89 6.96,22.82 6.09,22.82 5.34,23.57 4.29,23.57 U9.11
ICE_MOSI: length 36.4
  Top Layer w0.203: v1(22.22,12.14) 22.22,12.09 22.33,11.99 23.17,11.99 23.21,12.03 25.17,12.03 U1.17 ; 13.54,27.79 7.09,21.34 U9.14
  Bottom Layer w0.203: v1(22.22,12.14) 22.12,12.24 21.11,12.24 20.6,11.74 18.45,11.74 17.99,12.19 17.99,15.61 16.04,17.56 14.29,17.56 13.39,16.66 9.64,16.66 9.41,16.89 9.41,18.26 6.53,21.15 U9.14
ICE_SCK: length 60.4
  Top Layer w0.203: U5.16 20.63,32.09 20.55,32.01 20.55,30.56 21.72,29.39 21.72,24.28 v1(21.31,23.88) ; U1.15 25.11,13.18 24.78,13.18 24.61,13.36 v1(22.94,13.36)
  Bottom Layer w0.203: U9.12 5.47,23.88 5.04,24.3 5.04,24.31 4.42,24.93 3.55,24.93 2.93,24.31 2.93,23.44 3.55,22.82 5.66,22.82 5.97,22.52 6.54,22.52 6.67,22.39 6.96,22.39 7.58,21.77 7.58,20.9 7.54,20.86 7.54,20.57 9.72,18.39 9.72,17.06 9.81,16.97 13.26,16.97 14.17,17.88 16.15,17.88 18.3,15.73 18.3,12.32 18.58,12.04 20.47,12.04 21.79,13.36 v1(22.94,13.36) 23.14,13.56 23.17,13.56 23.5,13.89 23.5,16.04 22.27,17.27 22.22,17.27 21.51,17.98 20.98,17.98 20.65,18.31 20.65,18.85 v1(19.48,20.02) 19.48,22.05 v1(21.31,23.88)
ICE_SS: length 52.6
  Top Layer w0.203: U9.13 5.04,21.34 6.09,20.28 8.41,20.28 10.49,18.2 11.08,18.2 12.08,17.2 ; 12.08,17.2 H4.1 ; 12.08,17.2 12.1,17.2 v1(12.62,17.73) ; v1(17.07,23.72) 17.07,23.11 16.91,22.94 16.91,22.88 14.84,20.8 v1(13.9,20.8) ; U1.16 22.96,12.58 v1(22.94,12.6) ; v1(20.81,25.5) 21.11,25.8 21.11,28.75 20.99,28.87 20.62,28.87 v1(20.53,28.96) 20.31,29.18 U5.21
  Bottom Layer w0.203: v1(12.62,17.73) 13.9,19 v1(13.9,20.8) ; H4.1 18.16,11.12 22.02,11.12 22.5,11.61 23.37,11.61 23.86,11.12 25.73,11.12 25.88,11.28 25.88,12.29 25.58,12.6 v1(22.94,12.6) ; v1(17.07,23.72) 19.38,23.72 20.81,25.15 v1(20.81,25.5)
LED_B: length 43
  Top Layer w0.203: U1.39 32.09,9.64 v1(34.16,9.64) ; 6.48,11.18 9.95,11.18 10.2,11.42 10.59,11.42 10.87,11.14 10.87,11.05 LED3.4
  Bottom Layer w0.203: v1(34.16,9.64) 34.42,9.38 34.42,9.03 33.46,8.08 33.43,8.08 28.25,2.9 13.44,2.9 12.83,3.51 12.83,5.41 7.06,11.18 U9.22
LED_G: length 51.4
  Top Layer w0.203: LED3.3 9.36,9.69 6.04,9.69 4.99,8.64 3.94,8.64 ; U1.40 33.81,10.08 34.15,10.41 v1(34.16,10.41)
  Bottom Layer w0.203: v1(34.16,10.41) 33.96,10.62 33.93,10.62 33.6,10.95 33.6,11.41 33.93,11.74 34.39,11.74 35.03,11.1 35.03,8.78 33.72,7.47 33.69,7.47 33.36,7.14 33.36,7.11 28.53,2.29 10.34,2.29 U9.23
LED_R: length 42.5
  Top Layer w0.203: v1(34.16,11.18) 34.03,11.18 33.44,10.58 U1.41 ; 6.48,8.64 9.94,8.64 LED3.2
  Bottom Layer w0.203: U9.24 7.27,8.64 13.31,2.59 28.38,2.59 33.56,7.77 33.59,7.77 34.72,8.9 34.72,10.98 34.62,11.08 34.26,11.08 v1(34.16,11.18)
RXD: length 56.9
  Top Layer w0.203: v1(27.41,24.31) 27.38,24.33 25.19,24.33 23.74,22.88 23.74,21.99 U5.39 ; 44.83,36.58 44.83,36.02 43.34,34.53 43.34,33.6 42.73,32.98 41.19,32.98 39.13,30.92 39.13,27.52 38.62,27.01 38.62,26.76 34.06,22.2 34.06,21.44 32.03,19.4 32.03,16.49 31.29,15.75 30.73,15.75 30.38,15.39 U1.3
  Bottom Layer w0.203: 44.78,36.58 44.2,36.58 43.15,35.52 38.49,35.52 27.41,24.44 v1(27.41,24.31)
TXD: length 60.3
  Top Layer w0.203: 42.29,36.58 42.39,36.68 43.34,36.68 44.39,37.73 45.27,37.73 45.88,37.11 45.88,36.24 45.83,36.19 45.83,36.14 45.22,35.52 44.77,35.52 43.68,34.43 43.68,33.6 43.65,33.58 43.65,33.47 42.85,32.68 41.31,32.68 39.43,30.8 39.43,27.39 38.92,26.89 38.92,26.63 34.37,22.07 34.37,21.31 32.34,19.28 32.34,16.37 31.4,15.43 30.95,15.43 30.95,14.91 30.88,14.84 U1.2 ; U5.38 23.13,23.16 25.17,25.2 27.36,25.2 v1(27.41,25.25)
  Bottom Layer w0.203: U10.1 38.74,36.58 v1(27.41,25.25)
$1N810: length 2.8
  Top Layer w0.203: U1.29 27.88,7.1 27.71,6.94 27.71,5.97 28.22,5.46 R1.1
$1N2515: length 6.6
  Top Layer w0.203: v1(25.53,37.85) 25.63,37.74 U2.A5 ; R2.2 28.19,38.74 v1(28.07,38.86)
  Bottom Layer w0.203: v1(28.07,38.86) 28.01,38.92 26.1,38.92 25.53,38.35 v1(25.53,37.85)
$1N2572: length 6.5
  Top Layer w0.203: R3.2 19.75,38.63 19.75,38.64 20.38,38.64 20.38,38.63 20.47,38.63 v1(20.7,38.86) ; v1(23.24,37.85) 23.14,37.85 22.73,37.44 22.73,36.81 U2.B5
  Bottom Layer w0.203: v1(23.24,37.85) 22.22,38.86 v1(20.7,38.86)
$1N8265: length 6.2
  Top Layer w0.203: R4.2 23.9,34.98 v1(23.9,34.8) ; v1(25.53,31.24) 25.53,32.88 U5.6
  Bottom Layer w0.203: v1(25.53,31.24) 25.53,33.17 v1(23.9,34.8)
$1N8293: length 6.6
  Top Layer w0.203: R5.2 v1(22.11,35) ; U5.14 21.67,32.95 v1(21.67,31.24)
  Bottom Layer w0.203: v1(22.11,35) 22.11,31.68 v1(21.67,31.24)
$1N8446: length 29.7
  Top Layer w0.203: U5.37 22.74,21.78 22.74,20.96 22.97,20.73 28.3,20.73 29.17,21.6 C29.1 30.42,22.13 30.42,23.19 29.93,23.68 ; 28.32,31.08 28.02,30.77 28.02,24.15 28.35,23.82 28.98,23.82 29.01,23.79 29.19,23.79 29.3,23.68 U5.49 ; 28.32,31.08 26.16,31.08 25.61,30.53 23.66,30.53 22.53,31.66 22.53,32.88 U5.12 ; 28.32,31.08 29.83,31.08 U5.64
$1N8806: length 9.9
  Top Layer w0.203: C27.1 30.4,33.98 30.4,33.52 ; 30.4,33.52 30.5,33.62 30.67,33.62 31.64,34.59 31.96,34.59 32.09,34.72 C26.1 ; 30.4,33.52 L2.2 29.97,32.89 28.42,34.44 27.28,34.44 26.74,33.91 26.74,33.09 U5.4
$1N8835: length 10.8
  Top Layer w0.203: 16.78,29.92 16.78,31.14 18.66,33.02 L1.2 19.36,33.02 20.47,34.14 23.8,34.14 24.03,33.91 24.03,33.09 U5.9
$1N13148: length 23.2
  Top Layer w0.203: H1.1 37.06,28.76 35.81,30.01 35.81,31.05 36.54,31.78 37.45,31.78 37.95,32.28 37.96,32.28 38.1,32.43 38.1,33.84 37.96,33.99 36.84,33.99 36.5,34.33 36.5,34.34 U6.3 35.31,34.54 34.37,34.54 33.78,33.96 31.79,33.96 31.22,33.39 31.22,32.1 31.07,31.95 29.73,31.95 29.58,32.1 29.58,32.85 28.3,34.14 27.97,34.14 27.63,33.8 U5.2
$1N13558: length 1.5
  Top Layer w0.203: R9.1 34.52,25.78 34.52,25.83 34.37,25.97 34.33,25.97 34.3,26 U7.3
$1N14034: length 2.8
  Top Layer w0.203: R10.2 29,35.15 LED1.2
$1N15251: length 4.1
  Top Layer w0.203: U8.3 12.32,20.04 13.41,18.95 R14.1
$1N15327: length 5.6
  Top Layer w0.203: 18.59,21.31 19.36,21.31 20.09,20.58 20.09,19.65 20.09,19.65 20.09,18.21 R15.1
$1N15539: length 12.5
  Top Layer w0.203: H4.2 15.85,15.98 R13.1 15.85,17.34 12.58,20.61 10.39,20.61 10.03,20.97 10.03,21.69 10.91,22.58 U8.1

## Copper pours and planes (outline as drawn; the poured copper is in the pictures)
+3V3 on Inner1: 0.26,42.92 48.51,42.92 48.51,0.26 0.26,0.26
GND on Inner2: 0.26,42.92 48.51,42.92 48.51,0.26 0.26,0.26

Small or netless copper shapes (teardrops, artwork), in the pictures only: 276 on Top Layer, 67 on Bottom Layer, 16 on Inner1, 33 on Inner2

## Text on the board
Top Silkscreen Layer: MISO | SS | MOSI | SCK | 3v3 | GND | RST | RXD | TXD | 12M | 24 | 23 | 20 | 29 | 51 | 16 | G | 25 | 49 | 22 | 31 | 13 | 18 | B | R | 45 | 37 | 39 | 43 | 41 | 2 | 8 | 5 | 48 | 50 | 36 | 38 | 42 | 44 | 4 | 3 | 0 | disable | iCE SPI | reset hold | ext | osc | an iCE40UP5K board | flash | iCE | salvador
